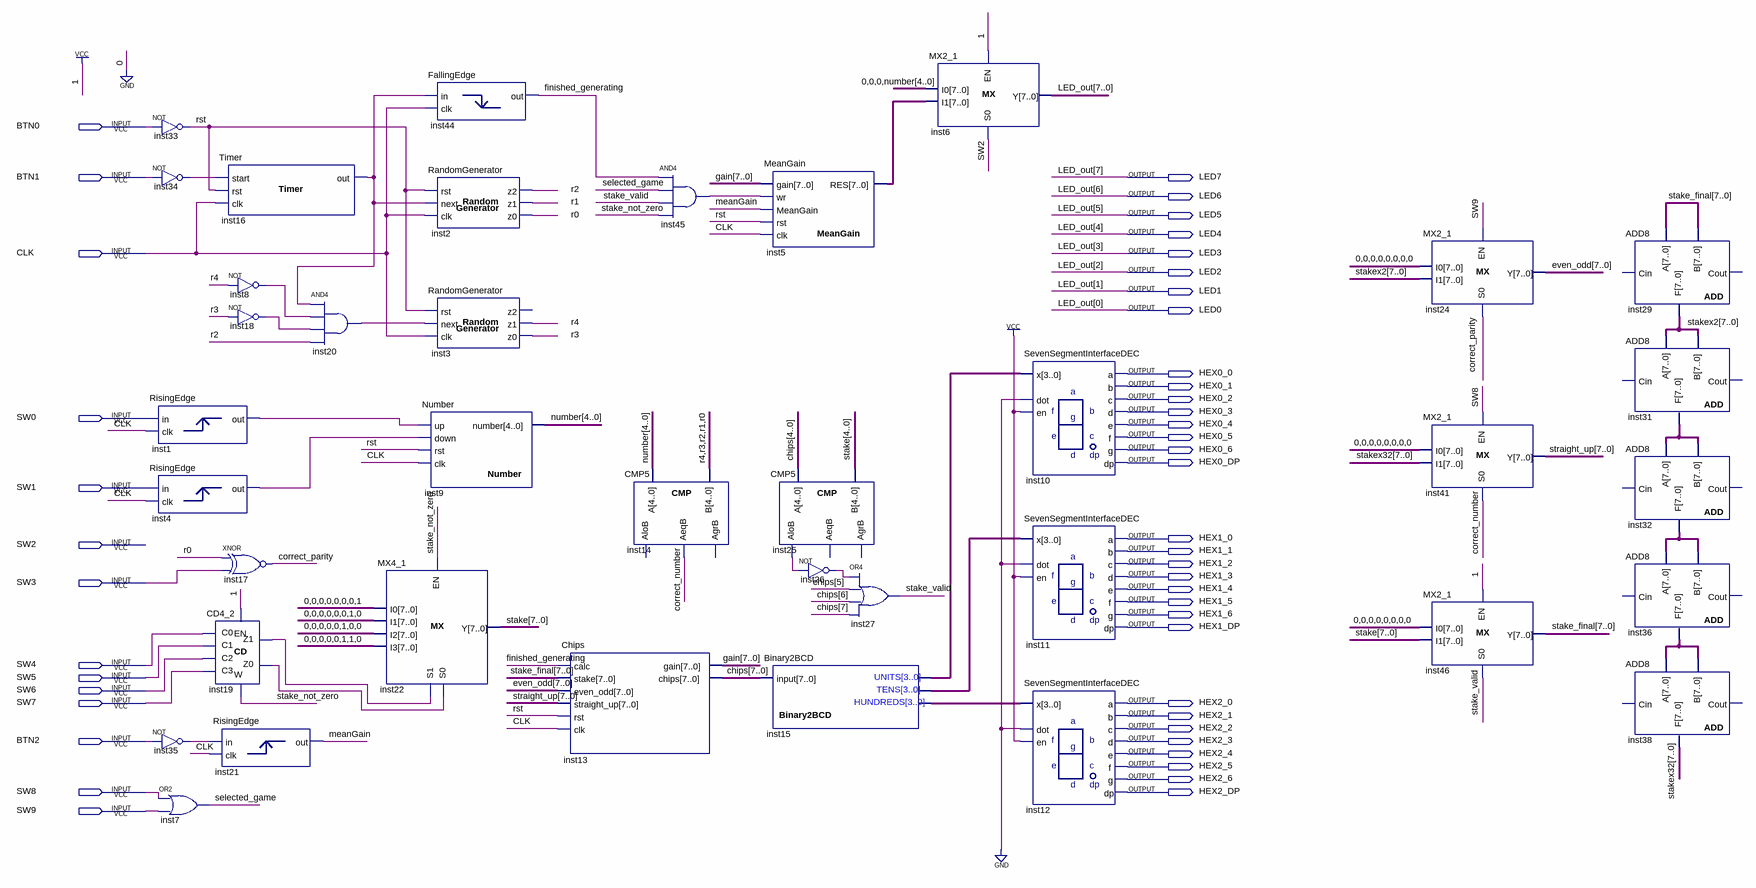
[diagram p0: schematic sheet]
// Quartus schematic PORT_LAB5.bdf as structural Verilog: 38 symbols, 46 pins
module PORT_LAB5 (
  input  BTN0,
  input  BTN1,
  input  CLK,
  input  SW0,
  input  SW1,
  input  SW2,
  input  SW3,
  input  SW4,
  input  SW5,
  input  SW6,
  input  SW7,
  input  BTN2,
  input  SW8,
  input  SW9,
  output LED7,
  output LED6,
  output LED5,
  output LED4,
  output LED3,
  output LED2,
  output LED1,
  output LED0,
  output HEX0_0,
  output HEX0_1,
  output HEX0_2,
  output HEX0_3,
  output HEX0_4,
  output HEX0_5,
  output HEX0_6,
  output HEX0_DP,
  output HEX1_0,
  output HEX1_1,
  output HEX1_2,
  output HEX1_3,
  output HEX1_4,
  output HEX1_5,
  output HEX1_6,
  output HEX1_DP,
  output HEX2_0,
  output HEX2_1,
  output HEX2_2,
  output HEX2_3,
  output HEX2_4,
  output HEX2_5,
  output HEX2_6,
  output HEX2_DP
);

  wire correct_number, correct_parity, finished_generating, inst1_output, inst4_output, inst8_out,
       inst16_out, inst18_out, inst19_z0, inst19_z1, inst20_out, inst25_alob, inst26_out, inst34_out,
       inst35_out, inst45_out, meanGain, r0, r1, r2, r3, r4, rst, selected_game, stake_not_zero, stake_valid;
  wire [3:0] inst15_bcd_hundreds, inst15_bcd_tens, inst15_bcd_units;
  wire [4:0] number;
  wire [7:0] chips, even_odd, gain, inst5_res, inst31_f, inst32_f, inst36_f, stake, stake_final, stakex2,
       stakex32, straight_up;

  not inst33 (rst, BTN0);
  not inst34 (inst34_out, BTN1);
  RisingEdge inst1 (.clk(CLK), .\input (SW0), .\output (inst1_output));
  RisingEdge inst4 (.clk(CLK), .\input (SW1), .\output (inst4_output));
  not inst35 (inst35_out, BTN2);
  or inst7 (selected_game, SW8, SW9);
  Timer inst16 (.start(inst34_out), .rst(rst), .clk(CLK), .out(inst16_out));
  CD4_2 inst19 (.C0(SW4), .C1(SW5), .C2(SW6), .C3(SW7), .EN(1'b1), .Z0(inst19_z0), .Z1(inst19_z1), .W(stake_not_zero));
  RisingEdge inst21 (.clk(CLK), .\input (inst35_out), .\output (meanGain));
  not inst8 (inst8_out, r4);
  not inst18 (inst18_out, r3);
  xnor inst17 (correct_parity, r0, SW3);
  and inst20 (inst20_out, inst16_out, inst8_out, inst18_out, r2);
  Number inst9 (.up(inst1_output), .down(inst4_output), .rst(rst), .clk(CLK), .number(number));
  MX4_1 inst22 (
    .I3(8'b00000110), .I2(8'b00000100), .I1(8'b00000010), .I0(8'b00000001), .S1(inst19_z1), .S0(inst19_z0),
    .EN(stake_not_zero), .Y(stake));
  FallingEdge inst44 (.clk(CLK), .\input (inst16_out), .\output (finished_generating));
  RandomGenerator inst2 (.NXT(inst16_out), .RST(rst), .CLK(CLK), .Z2(r2), .Z1(r1), .Z0(r0));
  RandomGenerator inst3 (.NXT(inst20_out), .RST(rst), .CLK(CLK), .Z1(r4), .Z0(r3));  // open: Z2
  Chips inst13 (
    .calc(finished_generating), .stake(stake_final), .even_odd(even_odd), .straight_up(straight_up),
    .rst(rst), .clk(CLK), .gain(gain), .chips(chips));
  CMP5 inst14 (.A(number), .B({r4, r3, r2, r1, r0}), .AeqB(correct_number));  // open: AgrB, AloB
  and inst45 (inst45_out, finished_generating, selected_game, stake_valid, stake_not_zero);
  MeanGain inst5 (.gain(gain), .wr(inst45_out), .MeanGain(meanGain), .rst(rst), .clk(CLK), .RES(inst5_res));
  CMP5 inst25 (.A(chips[4:0]), .B(stake[4:0]), .AloB(inst25_alob));  // open: AgrB, AeqB
  Binary2BCD inst15 (
    .\input (chips), .bcd_hundreds(inst15_bcd_hundreds), .bcd_tens(inst15_bcd_tens),
    .bcd_units(inst15_bcd_units));
  not inst26 (inst26_out, inst25_alob);
  or inst27 (stake_valid, inst26_out, chips[5], chips[6], chips[7]);
  MX2_1 inst6 (
    .I1(inst5_res), .I0({3'b000, number}), .S0(SW2), .EN(1'b1),
    .Y({LED7, LED6, LED5, LED4, LED3, LED2, LED1, LED0}));
  SevenSegmentInterfaceDEC inst10 (
    .dot(1'b0), .en(1'b1), .x(inst15_bcd_units), .a(HEX0_0), .b(HEX0_1), .c(HEX0_2), .d(HEX0_3), .e(HEX0_4),
    .f(HEX0_5), .g(HEX0_6), .dp(HEX0_DP));
  SevenSegmentInterfaceDEC inst11 (
    .dot(1'b0), .en(1'b1), .x(inst15_bcd_tens), .a(HEX1_0), .b(HEX1_1), .c(HEX1_2), .d(HEX1_3), .e(HEX1_4),
    .f(HEX1_5), .g(HEX1_6), .dp(HEX1_DP));
  SevenSegmentInterfaceDEC inst12 (
    .dot(1'b0), .en(1'b1), .x(inst15_bcd_hundreds), .a(HEX2_0), .b(HEX2_1), .c(HEX2_2), .d(HEX2_3),
    .e(HEX2_4), .f(HEX2_5), .g(HEX2_6), .dp(HEX2_DP));
  MX2_1 inst24 (.I1(stakex2), .I0({8{1'b0}}), .S0(correct_parity), .EN(SW9), .Y(even_odd));
  MX2_1 inst41 (.I1(stakex32), .I0({8{1'b0}}), .S0(correct_number), .EN(SW8), .Y(straight_up));
  MX2_1 inst46 (.I1(stake), .I0({8{1'b0}}), .S0(stake_valid), .EN(1'b1), .Y(stake_final));
  ADD8 inst29 (.A(stake_final), .B(stake_final), .F(stakex2));  // open: Cin, Cout
  ADD8 inst31 (.A(stakex2), .B(stakex2), .F(inst31_f));  // open: Cin, Cout
  ADD8 inst32 (.A(inst31_f), .B(inst31_f), .F(inst32_f));  // open: Cin, Cout
  ADD8 inst36 (.A(inst32_f), .B(inst32_f), .F(inst36_f));  // open: Cin, Cout
  ADD8 inst38 (.A(inst36_f), .B(inst36_f), .F(stakex32));  // open: Cin, Cout

  // Other names for the same wires on the sheet: LED_out[7:0] = {LED7, LED6, LED5, LED4, LED3, LED2, LED1, LED0}
endmodule
